# EAGLE design 6120 (EAGLE 6.6.0)
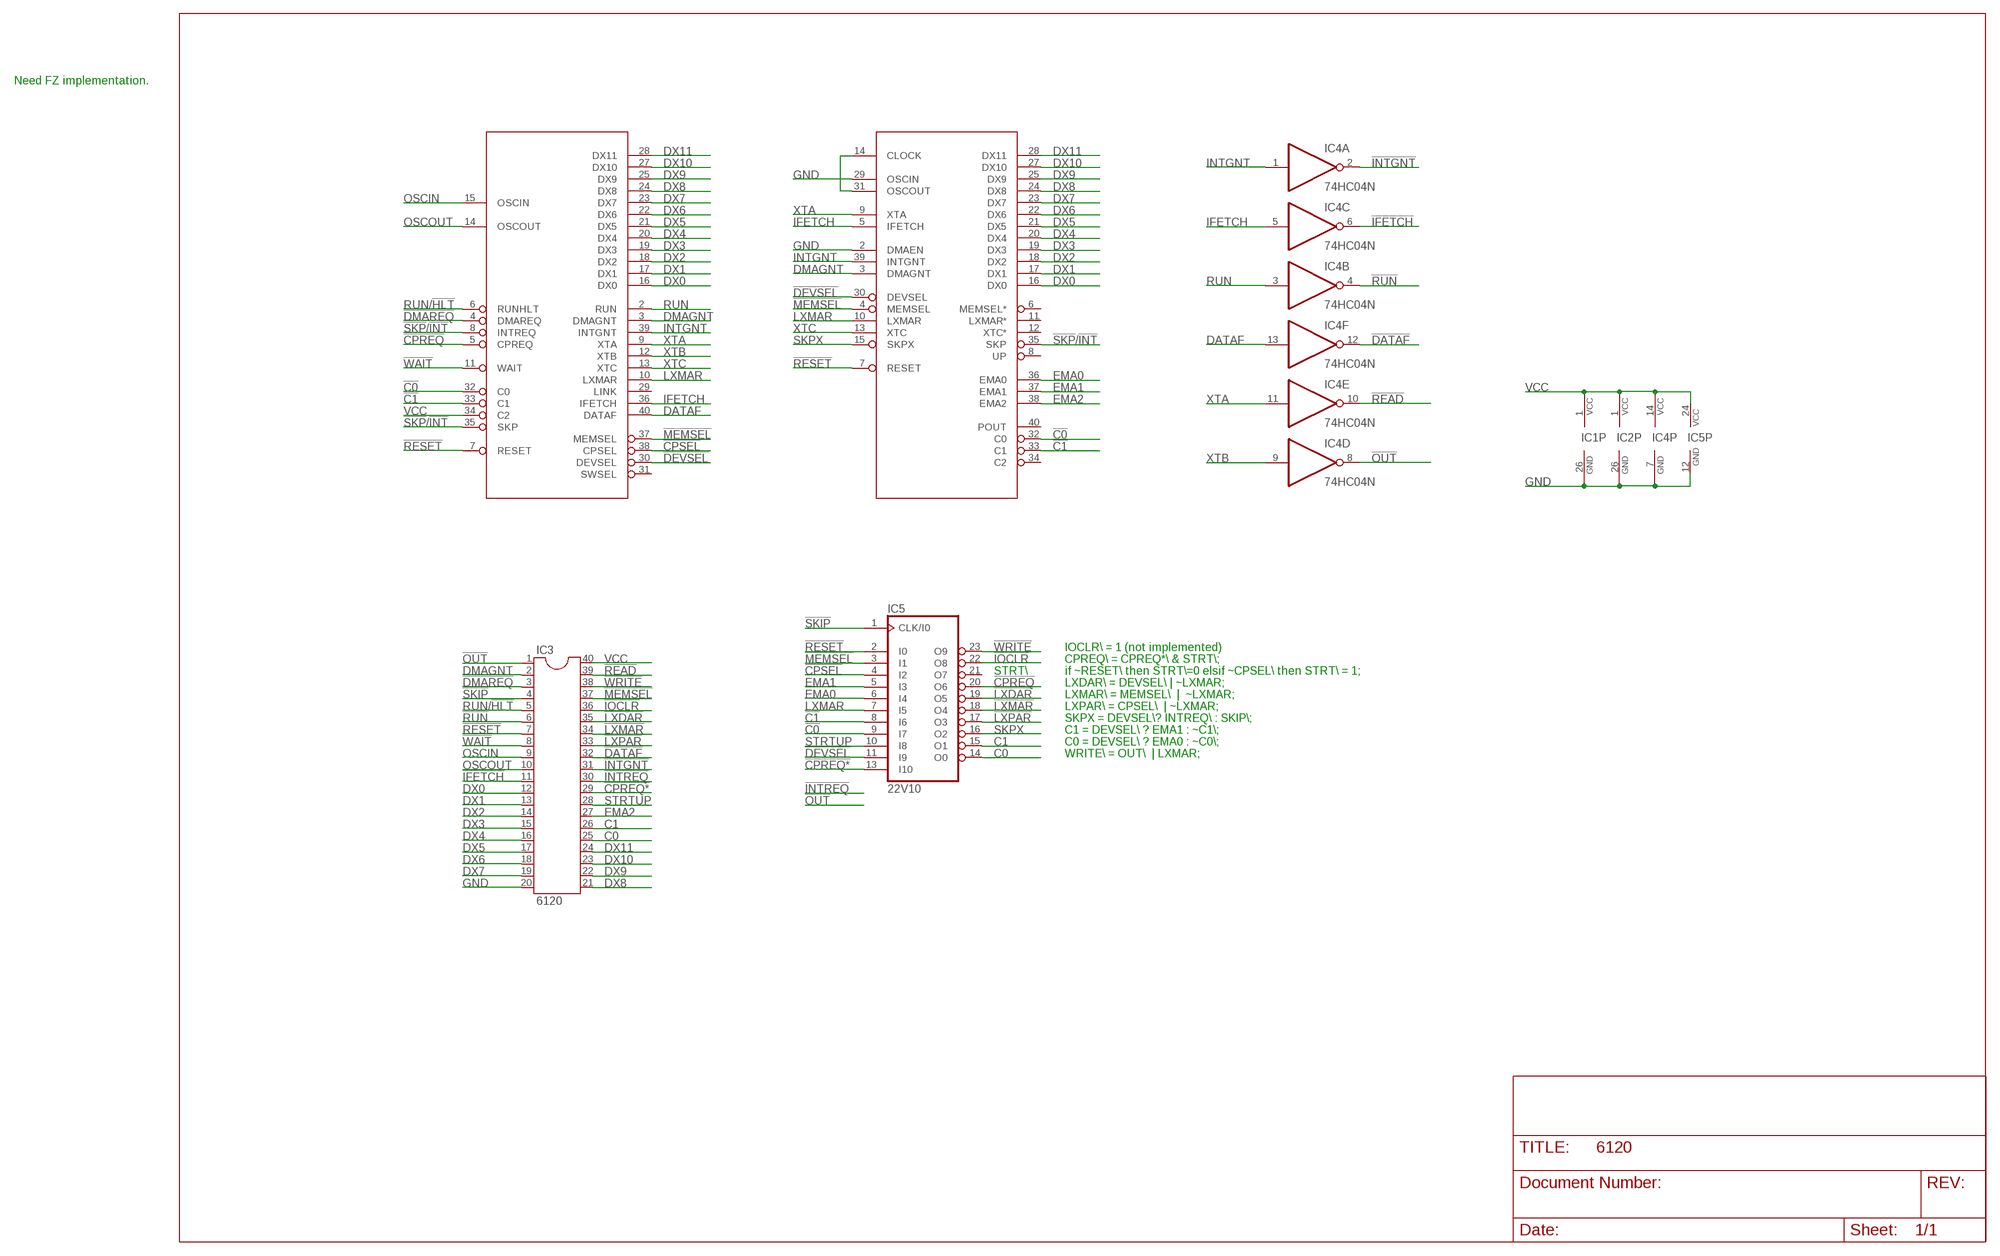
[diagram p0: schematic, sheet 1]

## Parts
IC1  IM6100  [DIL40]
IC2  IM6102  [DIL40]
IC3  6120  DIL40  [DIL40]
IC4  74HC04N  74S04N  [DIL14]
IC5  22V10  [DIL24-3]

## Nets
!C0: IC1.32(C0) IC2.32(C0) IC5.9(I7)
!C1: IC1.33(C1) IC2.33(C1) IC5.8(I6)
!CPREQ: IC1.5(CPREQ) IC5.20(O6)
!CPREQ*: IC3.29 IC5.13(I10)
!CPSEL: IC1.38(CPSEL) IC5.4(I2)
!DATAF: IC3.32 IC4.12(F:O)
!DEVSEL: IC1.30(DEVSEL) IC2.30(DEVSEL) IC5.11(I9)
!DMAREQ: IC1.4(DMAREQ) IC3.3
!IFETCH: IC3.11 IC4.6(C:O)
!INTGNT: IC3.31 IC4.2(A:O)
!INTREQ: IC3.30
!IOCLR: IC3.36 IC5.22(O8)
!LXDAR: IC3.35 IC5.19(O5)
!LXMAR: IC3.34 IC5.18(O4)
!LXPAR: IC3.33 IC5.17(O3)
!MEMSEL: IC1.37(MEMSEL) IC2.4(MEMSEL) IC3.37 IC5.3(I1)
!OUT: IC3.1 IC4.8(D:O)
!READ: IC3.39 IC4.10(E:O)
!RESET: IC1.7(RESET) IC2.7(RESET) IC3.7 IC5.2(I0)
!RUN: IC3.6 IC4.4(B:O)
!SKIP: IC3.4 IC5.1(CLK/I0)
!SKP!/!INT: IC1.8(INTREQ) IC1.35(SKP) IC2.35(SKP)
!WAIT: IC1.11(WAIT) IC3.8
!WRITE: IC3.38 IC5.23(O9)
C0: IC3.25 IC5.14(O0)
C1: IC3.26 IC5.15(O1)
DATAF: IC1.40(DATAF) IC4.13(F:I)
DMAGNT: IC1.3(DMAGNT) IC2.3(DMAGNT) IC3.2
DX0: IC1.16(DX0) IC2.16(DX0) IC3.12
DX1: IC1.17(DX1) IC2.17(DX1) IC3.13
DX2: IC1.18(DX2) IC2.18(DX2) IC3.14
DX3: IC1.19(DX3) IC2.19(DX3) IC3.15
DX4: IC1.20(DX4) IC2.20(DX4) IC3.16
DX5: IC1.21(DX5) IC2.21(DX5) IC3.17
DX6: IC1.22(DX6) IC2.22(DX6) IC3.18
DX7: IC1.23(DX7) IC2.23(DX7) IC3.19
DX8: IC1.24(DX8) IC2.24(DX8) IC3.21
DX9: IC1.25(DX9) IC2.25(DX9) IC3.22
DX10: IC1.27(DX10) IC2.27(DX10) IC3.23
DX11: IC1.28(DX11) IC2.28(DX11) IC3.24
EMA0: IC2.36(EMA0) IC5.6(I4)
EMA1: IC2.37(EMA1) IC5.5(I3)
EMA2: IC2.38(EMA2) IC3.27
GND: IC1.26(GND) IC2.2(DMAEN) IC2.26(GND) IC2.29(OSCIN) IC3.20 IC4.7(P:GND) IC5.12(GND)
IFETCH: IC1.36(IFETCH) IC2.5(IFETCH) IC4.5(C:I)
INTGNT: IC1.39(INTGNT) IC2.39(INTGNT) IC4.1(A:I)
LXMAR: IC1.10(LXMAR) IC2.10(LXMAR) IC5.7(I5)
N$1: IC2.14(CLOCK) IC2.31(OSCOUT)
OSCIN: IC1.15(OSCIN) IC3.9
OSCOUT: IC1.14(OSCOUT) IC3.10
RUN: IC1.2(RUN) IC4.3(B:I)
RUN/!HLT: IC1.6(RUNHLT) IC3.5
SKPX: IC2.15(SKPX) IC5.16(O2)
STRTUP: IC3.28 IC5.10(I8)
VCC: IC1.1(VCC) IC1.34(C2) IC2.1(VCC) IC3.40 IC4.14(P:VCC) IC5.24(VCC)
XTA: IC1.9(XTA) IC2.9(XTA) IC4.11(E:I)
XTB: IC1.12(XTB) IC4.9(D:I)
XTC: IC1.13(XTC) IC2.13(XTC)
Unconnected: IC1.29(LINK) IC1.31(SWSEL) IC2.6(MEMSEL*) IC2.8(UP) IC2.11(LXMAR*) IC2.12(XTC*) IC2.34(C2) IC2.40(POUT) IC5.21(O7)

## Notes on the sheet
- Need FZ implementation.
- IOCLR\\ = 1 (not implemented)
- CPREQ\\ = CPREQ*\\ & STRT\\;
- STRT\\ | if ~RESET\\ then STRT\\=0 elsif ~CPSEL\\ then STRT\\ = 1;
- LXDAR\\ = DEVSEL\\ | ~LXMAR;
- LXMAR\\ = MEMSEL\\  |  ~LXMAR;
- LXPAR\\ = CPSEL\\  | ~LXMAR;
- SKPX = DEVSEL\\? INTREQ\\ : SKIP\\;
- C1 = DEVSEL\\ ? EMA1 : ~C1\\;
- C0 = DEVSEL\\ ? EMA0 : ~C0\\;
- WRITE\\ = OUT\\  | LXMAR;

## Library data of the parts
IC1 = dec-con:IM6100: IM6100 PDP-8 on a chip.
IC2 = dec-con:IM6102: MEDIC MMU/DMA/RTC for IM6100.
IC3 = ic-package:DIL40: Dual In Line
IC4 = 74xx-us:74*04: Hex INVERTER
IC5 = pal:22V10: PAL; MPN: GAL22V10D-7LPN; OC_FARNELL: 1571925; OC_NEWARK: 97M0480

## Board
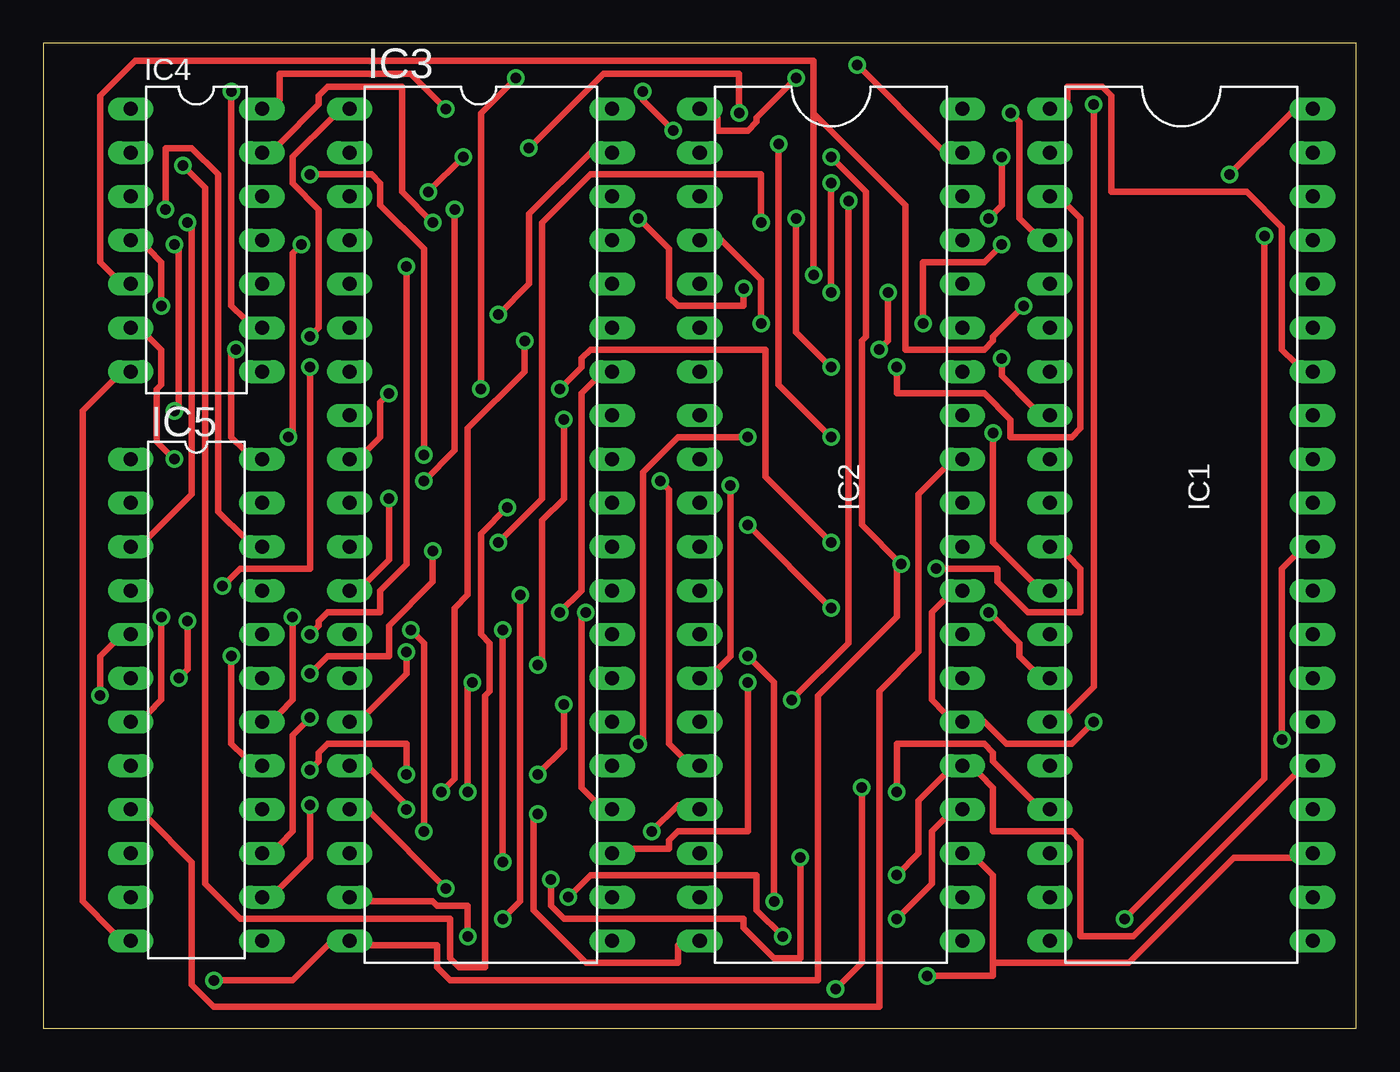
[diagram p1: board, top side]
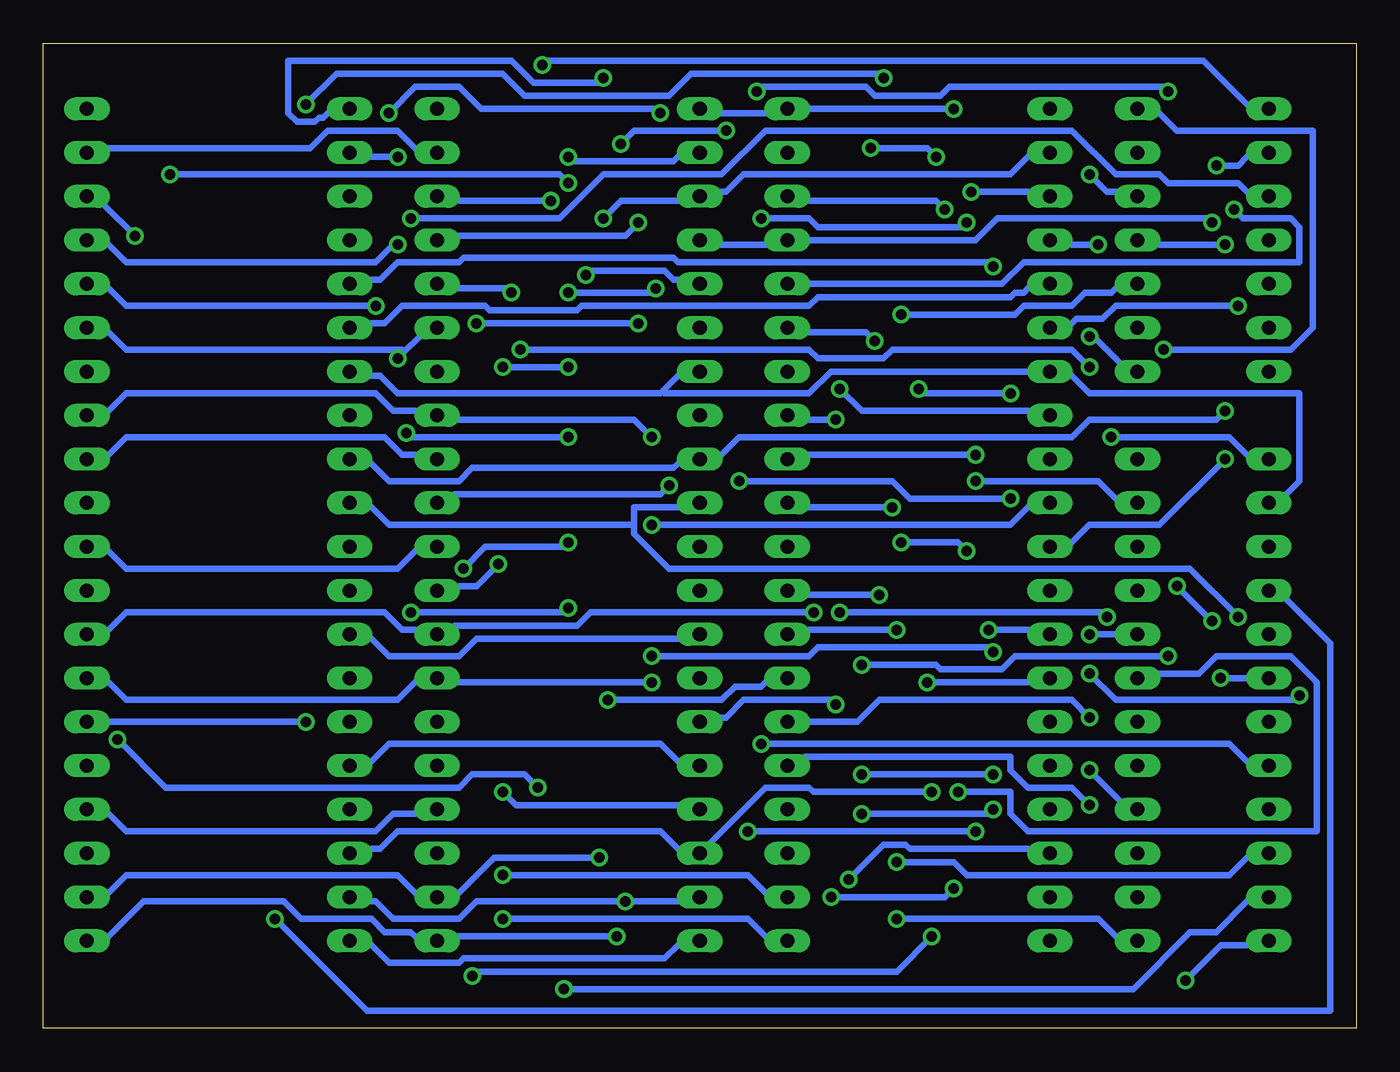
[diagram p2: board, bottom side, seen from below]

Size 76.2 x 57.15 mm. Coordinates in mm from the lower left corner, seen from the top.
Outline: 0,0 76.2,0 76.2,57.15 0,57.15 0,0
Copper layers (1*16): Top 0.035mm / dielectric 1.5mm / Bottom 0.035mm
Design rules "15mils": minimum track width 15mil, minimum drill 24mil, track to track 15mil, track to pad 10mil, pad to pad 10mil, via to via 10mil, smd to smd 10mil, copper to edge 25mil, drill to drill 10mil, minimum pad ring 10mil, minimum via ring 8mil, stop-mask expansion 0mil, vias tented up to drill 0mil, thermal gap 10mil

### Footprints (pad centres in the part's own frame; a part is rotated, then mirrored left to right if it is on the bottom)
DIL40 = drill 0.813 long: 1 -24.13,-7.62; 2 -21.59,-7.62; 3 -19.05,-7.62; 4 -16.51,-7.62; 5 -13.97,-7.62; 6 -11.43,-7.62; 7 -8.89,-7.62; 8 -6.35,-7.62; 9 -3.81,-7.62; 10 -1.27,-7.62; 11 1.27,-7.62; 12 3.81,-7.62; 13 6.35,-7.62; 14 8.89,-7.62; 15 11.43,-7.62; 16 13.97,-7.62; 17 16.51,-7.62; 18 19.05,-7.62; 19 21.59,-7.62; 20 24.13,-7.62; 21 24.13,7.62; 22 21.59,7.62; 23 19.05,7.62; 24 16.51,7.62; 25 13.97,7.62; 26 11.43,7.62; 27 8.89,7.62; 28 6.35,7.62; 29 3.81,7.62; 30 1.27,7.62; 31 -1.27,7.62; 32 -3.81,7.62; 33 -6.35,7.62; 34 -8.89,7.62; 35 -11.43,7.62; 36 -13.97,7.62; 37 -16.51,7.62; 38 -19.05,7.62; 39 -21.59,7.62; 40 -24.13,7.62
DIL14 = drill 0.813 long: 1 -7.62,-3.81; 2 -5.08,-3.81; 3 -2.54,-3.81; 4 0,-3.81; 5 2.54,-3.81; 6 5.08,-3.81; 7 7.62,-3.81; 8 7.62,3.81; 9 5.08,3.81; 10 2.54,3.81; 11 0,3.81; 12 -2.54,3.81; 13 -5.08,3.81; 14 -7.62,3.81
DIL24-3 = drill 0.813 long: 1 -13.97,-3.81; 2 -11.43,-3.81; 3 -8.89,-3.81; 4 -6.35,-3.81; 5 -3.81,-3.81; 6 -1.27,-3.81; 7 1.27,-3.81; 8 3.81,-3.81; 9 6.35,-3.81; 10 8.89,-3.81; 11 11.43,-3.81; 12 13.97,-3.81; 13 13.97,3.81; 14 11.43,3.81; 15 8.89,3.81; 16 6.35,3.81; 17 3.81,3.81; 18 1.27,3.81; 19 -1.27,3.81; 20 -3.81,3.81; 21 -6.35,3.81; 22 -8.89,3.81; 23 -11.43,3.81; 24 -13.97,3.81

### Placement (x,y rotation side)
IC1  66.04,29.21 270 top
IC2  45.72,29.21 270 top
IC3  25.4,29.21 270 top
IC4  8.89,45.72 270 top
IC5  8.89,19.05 270 top

### Tracks (layer width: path | path; a pad name or v marks a point on that pad's centre or on a via)
!C0
  Top 0.381: IC5.9 6.1,12.19 8.64,9.65 8.64,2.54 9.91,1.27 48.51,1.27 48.51,19.56 50.8,21.84 50.8,30.99 52.32,32.51 IC2.32
  Bottom 0.381: IC1.32 72.39,33.27 71.37,34.29 56.39,34.29 55.37,33.27 54.61,33.27 IC2.32
!C1  (via drill 0.61)
  Top 0.381: v34.54,16.51 34.8,16.76 34.8,32.26 36.83,34.29 v40.89,34.29
  Bottom 0.381: v34.54,16.51 7.37,16.51 6.35,15.49 IC5.8 | v40.89,34.29 41.91,35.31 52.07,35.31 IC2.33 54.61,35.81 55.88,35.81 56.9,36.83 71.37,36.83 72.39,35.81 IC1.33
!CPREQ  (via drill 0.61)
  Top 0.381: v15.49,22.86 16,23.37 16,23.62 16.51,24.13 19.56,24.13 19.56,25.4 21.08,26.92 v21.08,44.2
  Bottom 0.381: v21.08,44.2 21.34,44.45 39.37,44.45 39.62,44.7 51.82,44.7 52.07,44.45 55.63,44.45 56.64,43.43 57.15,43.43 IC1.5 | IC5.20 v15.49,22.86
!CPREQ*  (via drill 0.61)
  Top 0.381: v26.67,6.35 27.69,7.37 v27.69,25.15
  Bottom 0.381: v26.67,6.35 14.99,6.35 13.97,5.33 IC5.13 | v27.69,25.15 31.75,25.15 IC3.29
!CPSEL  (via drill 0.61)
  Top 0.381: v62.74,6.35 70.87,14.48 v70.87,45.97
  Bottom 0.381: v62.74,6.35 57.4,1.02 1.52,1.02 1.52,22.35 4.06,24.89 IC5.4 | v70.87,45.97 72.64,47.75 IC1.38
!DATAF  (via drill 0.61)
  Top 0.381: v22.1,33.27 22.1,45.21 19.56,47.75 19.56,49.02 19.05,49.53 v15.49,49.53
  Bottom 0.381: v22.1,33.27 31.75,33.27 IC3.32 | v15.49,49.53 14.48,48.51 13.97,48.51 IC4.12
!DEVSEL  (via drill 0.61)
  Top 0.381: v45.97,2.29 47.5,3.81 v47.5,13.97 | v71.88,16.76 71.88,26.67 72.64,27.43 IC1.30
  Bottom 0.381: v45.97,2.29 12.95,2.29 9.65,5.59 8.13,5.59 6.35,7.37 IC5.11 | v47.5,13.97 48.26,14.73 51.31,14.73 52.07,13.97 69.09,13.97 v71.88,16.76 | IC2.30 54.61,27.69 55.63,26.67 71.37,26.67 72.39,27.69 IC1.30
!DMAREQ  (via drill 0.61)
  Top 0.381: v22.35,48.51 v24.38,50.55 | v28.19,51.05 32.51,55.37 40.39,55.37 v40.39,53.09 | v56.13,53.09 56.64,52.58 56.64,46.99 57.4,46.23 IC1.4
  Bottom 0.381: v22.35,48.51 19.05,48.51 IC3.3 | v24.38,50.55 24.89,51.05 v28.19,51.05 | v40.39,53.09 40.64,53.34 50.8,53.34 52.07,54.61 54.61,54.61 v56.13,53.09
!IFETCH  (via drill 0.61)
  Top 0.381: v7.62,33.02 6.6,34.04 6.6,37.08 6.86,37.34 6.86,39.37 6.1,40.13 IC4.6
  Bottom 0.381: v7.62,33.02 11.43,29.21 15.49,29.21 16.51,28.19 IC3.11
!INTGNT  (via drill 0.61)
  Top 0.381: v8.13,50.04 9.4,48.77 9.4,8.38 11.43,6.35 23.62,6.35 23.62,4.06 24.13,3.56 25.65,3.56 25.65,19.3 25.91,19.56 25.91,22.35 25.4,22.86 25.4,28.7 v26.92,30.23
  Bottom 0.381: v8.13,50.04 6.86,50.04 6.35,50.55 IC4.2 | v26.92,30.23 31.75,30.23 IC3.31
!IOCLR  (via drill 0.61)
  Top 0.381: v7.11,47.5 7.11,51.05 8.64,51.05 10.16,49.53 10.16,29.97 11.68,28.45 IC5.22
  Bottom 0.381: v7.11,47.5 6.6,46.99 3.81,46.99 3.3,46.48 3.3,44.45 19.3,44.45 20.57,43.18 IC3.36
!LXDAR  (via drill 0.61)
  Top 0.381: v23.11,13.72 23.88,14.48 23.88,24.38 24.64,25.15 24.64,34.8 27.94,38.1 v27.94,39.88
  Bottom 0.381: v23.11,13.72 20.07,13.72 20.07,12.45 19.05,11.43 2.29,11.43 2.29,20.07 3.81,21.59 8.13,21.59 9.14,20.57 11.43,20.57 IC5.19 | v27.94,39.88 28.45,40.39 31.75,40.39 IC3.35
!LXMAR  (via drill 0.61)
  Top 0.381: v14.48,23.88 14.48,19.05 13.72,18.29 IC5.18 | v29.97,24.13 31.24,25.4 31.24,36.83 32,37.59 IC3.34
  Bottom 0.381: v14.48,23.88 14.73,24.13 v29.97,24.13
!LXPAR  (via drill 0.61)
  Top 0.381: v10.92,21.59 10.92,16.51 11.68,15.75 IC5.17 | v28.7,21.08 28.96,21.34 28.96,29.46 30.23,30.73 v30.23,35.31
  Bottom 0.381: v10.92,21.59 19.81,21.59 20.57,20.83 24.13,20.83 24.38,21.08 v28.7,21.08 | v30.23,35.31 31.75,35.31 IC3.33
!MEMSEL  (via drill 0.61)
  Top 0.381: v8.38,46.74 8.64,46.48 8.64,30.99 6.1,28.45 IC5.3 | v55.63,45.47 54.61,44.45 51.05,44.45 v51.05,40.89 | v41.66,40.89 41.66,43.43 39.37,45.72 IC2.4
  Bottom 0.381: v8.38,46.74 8.64,46.99 20.83,46.99 22.1,45.72 IC3.37 34.29,45.47 36.83,45.47 IC2.4 | v55.63,45.47 55.88,45.47 56.9,44.45 71.37,44.45 72.39,45.47 IC1.37 | v41.66,40.89 v51.05,40.89
!OUT  (via drill 0.61)
  Top 0.381: v15.49,40.13 16,40.64 16,47.5 14.48,49.02 14.48,50.55 16.76,52.83 IC3.1
  Bottom 0.381: v15.49,40.13 15.24,40.13 13.72,38.61 IC4.8
!READ  (via drill 0.61)
  Top 0.381: v26.42,41.4 28.19,43.18 28.19,47.24 31.75,50.8 IC3.39
  Bottom 0.381: v26.42,41.4 19.81,41.4 19.3,41.91 16.51,41.91 15.75,42.67 14.22,42.67 13.97,42.93 IC4.10
!RESET
  Bottom 0.381: IC5.2 4.06,30.99 3.3,31.75 3.3,36.83 15.49,36.83 16.51,37.85 IC3.7 30.48,38.1 31.75,36.83 40.13,36.83 40.26,36.96 | 40.26,36.96 40.39,36.83 55.63,36.83 56.64,37.85 57.15,37.85 IC1.7 | 40.26,36.96 39.37,37.85 IC2.7
!RUN  (via drill 0.61)
  Top 0.381: v6.86,41.91 6.86,44.45 6.1,45.21 IC4.4
  Bottom 0.381: v6.86,41.91 13.97,41.91 14.73,41.15 16.26,41.15 16.51,40.89 IC3.6
!SKIP  (via drill 0.61)
  Top 0.381: v14.22,34.29 14.48,34.54 14.48,44.96 v14.99,45.47
  Bottom 0.381: v14.22,34.29 7.37,34.29 6.35,33.27 IC5.1 | v14.99,45.47 16.51,45.47 IC3.4
!SKP!/!INT  (via drill 0.61)
  Top 0.381: v55.63,38.86 55.63,37.85 57.4,36.07 IC1.8
  Bottom 0.381: 55.24,39.24 54.36,40.13 IC2.35 | v55.63,38.86 55.24,39.24 | IC1.35 72.39,40.39 71.37,39.37 55.37,39.37 55.24,39.24
!WAIT  (via drill 0.61)
  Top 0.381: v29.97,37.08 31.24,38.35 31.24,38.86 31.75,39.37 41.91,39.37 41.91,32 v45.72,28.19 | v51.82,26.67 55.37,26.67 55.37,25.91 57.15,24.13 60.2,24.13 60.2,26.67 59.44,27.43 IC1.11
  Bottom 0.381: v29.97,37.08 28.7,35.81 19.05,35.81 IC3.8 | v45.72,28.19 45.97,27.94 50.55,27.94 v51.82,26.67
!WRITE  (via drill 0.61)
  Top 0.381: v22.1,31.75 23.88,33.53 v23.88,47.5
  Bottom 0.381: v22.1,31.75 14.99,31.75 13.97,30.73 IC5.23 | v23.88,47.5 24.38,48.01 31.75,48.01 IC3.38
C0  (via drill 0.61)
  Top 0.381: v15.49,12.95 15.49,9.91 13.72,8.13 IC5.14
  Bottom 0.381: v15.49,12.95 16.51,13.97 19.05,13.97 20.07,14.99 20.07,15.75 32,15.75 IC3.25
C1  (via drill 0.61)
  Top 0.381: v15.49,18.03 14.48,17.02 14.48,11.43 13.72,10.67 IC5.15
  Bottom 0.381: v15.49,18.03 16.51,19.05 27.69,19.05 28.96,17.78 IC3.26
DATAF  (via drill 0.61)
  Top 0.381: v22.61,46.74 20.83,48.51 20.83,54.61 16.51,54.61 16,54.1 16,53.59 13.72,51.31 IC4.13 | v34.54,46.99 36.32,45.21 36.32,42.42 36.83,41.91 40.64,41.91 v40.64,42.93 | v45.72,42.67 v45.72,49.02 | v68.83,49.53 72.39,53.09 IC1.40
  Bottom 0.381: v22.61,46.74 22.86,46.48 31.24,46.48 31.75,46.99 v34.54,46.99 | v40.64,42.93 40.89,42.67 v45.72,42.67 | v45.72,49.02 46.23,49.53 v68.83,49.53
DMAGNT  (via drill 0.61)
  Top 0.381: v49.53,38.35 49.53,36.83 54.61,36.83 56.13,35.31 56.13,34.29 59.69,34.29 60.2,34.8 60.2,46.99 59.44,47.75 IC1.3 | v45.72,38.35 43.69,40.39 v43.69,46.99
  Bottom 0.381: IC3.2 19.05,50.55 20.07,49.53 35.56,49.53 36.58,48.51 36.83,48.51 IC2.3 39.37,48.01 42.67,48.01 v43.69,46.99 | v45.72,38.35 v49.53,38.35
DX0  (via drill 0.61)
  Top 0.381: v20.07,30.73 20.07,27.18 18.8,25.91 IC3.12 | v35.81,31.75 36.32,31.24 36.32,16.51 37.08,15.75 IC2.16
  Bottom 0.381: IC2.16 39.37,15.49 40.39,16.51 56.13,16.51 57.15,15.49 IC1.16 | v20.07,30.73 25.91,30.73 26.92,31.75 v35.81,31.75
DX1  (via drill 0.61)
  Top 0.381: v21.34,23.11 22.1,22.35 v22.1,11.43 | v35.31,11.43 36.83,12.95 IC2.17 | v49.53,13.72 49.53,16.51 54.61,16.51 55.12,16 55.12,15.49 57.4,13.21 IC1.17
  Bottom 0.381: v21.34,23.11 19.05,23.11 IC3.13 | v22.1,11.43 v35.31,11.43 | v49.53,13.72 48.77,12.95 39.37,12.95 IC2.17
DX2  (via drill 0.61)
  Top 0.381: v24.89,20.07 24.64,19.81 v24.64,13.72
  Bottom 0.381: IC1.18 57.15,10.41 56.64,10.41 55.63,11.43 40.39,11.43 39.37,10.41 IC2.18 34.29,13.97 31.75,13.97 31.5,13.72 v24.64,13.72 | v24.89,20.07 19.05,20.07 IC3.14
DX3  (via drill 0.61)
  Top 0.381: v21.08,21.84 21.08,20.57 18.8,18.29 IC3.15 | v40.89,21.59 42.42,20.07 v42.42,7.37
  Bottom 0.381: IC2.19 39.37,7.37 v42.42,7.37 51.05,7.37 52.07,6.35 55.88,6.35 56.9,7.37 57.15,7.37 IC1.19 | v21.08,21.84 21.34,22.1 31.24,22.1 31.75,21.59 v40.89,21.59
DX4  (via drill 0.61)
  Top 0.381: v21.08,12.7 21.08,12.95 19.05,14.99 IC3.16 | v28.7,12.45 28.45,12.19 28.45,6.86 31.5,3.81 36.83,3.81 36.83,4.83 IC2.20
  Bottom 0.381: IC2.20 39.37,4.83 40.13,4.06 51.82,4.06 52.07,3.81 56.13,3.81 57.15,4.83 IC1.20 | v21.08,12.7 21.34,12.45 v28.7,12.45
DX5  (via drill 0.61)
  Top 0.381: v23.37,8.13 19.05,12.45 IC3.17 | v30.48,7.62 31.75,8.89 41.4,8.89 41.4,6.86 v42.93,5.33
  Bottom 0.381: IC1.21 72.39,5.33 70.36,7.37 62.23,7.37 61.21,6.35 57.15,6.35 56.39,5.59 54.86,5.59 54.61,5.33 IC2.21 52.07,5.33 v42.93,5.33 | v23.37,8.13 23.88,7.62 v30.48,7.62
DX6  (via drill 0.61)
  Top 0.381: v29.46,8.64 29.46,7.11 30.23,6.35 40.64,6.35 40.64,5.84 42.42,4.06 43.94,4.06 v43.94,9.91
  Bottom 0.381: IC1.22 72.39,7.87 71.37,8.89 55.63,8.89 54.61,7.87 IC2.22 52.07,7.87 50.04,9.91 v43.94,9.91 | v29.46,8.64 27.43,10.67 26.16,10.67 25.91,10.41 19.05,10.41 IC3.18
DX7  (via drill 0.61)
  Top 0.381: v24.64,5.33 24.64,7.11 22.86,7.11 22.61,7.37 19.05,7.37 IC3.19 | v51.31,3.05 55.12,3.05 55.12,3.81 | 55.12,3.81 55.12,8.89 54.36,9.65 IC2.23 | 55.12,3.81 62.99,3.81 69.09,9.91 72.39,9.91 IC1.23
  Bottom 0.381: v24.64,5.33 26.67,3.3 51.05,3.3 v51.31,3.05
DX8  (via drill 0.61)
  Top 0.381: v49.53,6.35 51.56,8.38 51.56,11.43 52.32,12.19 IC2.24
  Bottom 0.381: v49.53,6.35 35.31,6.35 34.29,5.33 IC3.21 | IC1.24 72.39,12.45 71.37,11.43 56.9,11.43 55.88,12.45 54.61,12.45 IC2.24
DX9  (via drill 0.61)
  Top 0.381: v49.53,8.89 50.8,10.16 50.8,13.21 52.32,14.73 IC2.25 54.36,14.73 55.12,13.97 55.12,11.43 59.69,11.43 60.2,10.92 60.2,5.33 63.25,5.33 72.64,14.73 IC1.25
  Bottom 0.381: v49.53,8.89 35.31,8.89 34.29,7.87 IC3.22
DX10  (via drill 0.61)
  Top 0.381: v40.89,20.07 40.89,11.43 36.83,11.43 36.32,10.92 36.32,10.41 34.29,10.41 IC3.23
  Bottom 0.381: v40.89,20.07 52.07,20.07 IC2.27 54.61,20.07 55.63,19.05 71.37,19.05 72.39,20.07 IC1.27
DX11  (via drill 0.61)
  Top 0.381: v31.5,24.13 31.24,23.88 31.24,13.97 32,13.21 IC3.24
  Bottom 0.381: v31.5,24.13 44.45,24.13 45.21,23.37 52.32,23.37 IC2.28 54.61,23.11 55.37,23.11 56.39,24.13 71.37,24.13 72.39,23.11 IC1.28
EMA0  (via drill 0.61)
  Top 0.381: v7.87,20.32 8.38,20.83 v8.38,23.62 | v10.41,25.65 11.43,26.67 15.49,26.67 v15.49,38.35 | v48.51,39.37 49.02,39.88 v49.02,42.67
  Bottom 0.381: v8.38,23.62 v10.41,25.65 | v15.49,38.35 16.51,39.37 26.92,39.37 27.43,38.86 31.24,38.86 31.75,39.37 v48.51,39.37 | v49.02,42.67 49.28,42.93 52.07,42.93 IC2.36 | IC5.6 v7.87,20.32
EMA1  (via drill 0.61)
  Top 0.381: v3.3,19.3 3.3,21.59 4.06,22.35 IC5.5 | v15.49,20.57 16.51,21.59 20.07,21.59 20.07,23.37 22.61,25.91 v22.61,27.69 | v26.42,28.19 28.96,30.73 28.96,46.74 31.75,49.53 41.66,49.53 v41.66,46.74
  Bottom 0.381: v3.3,19.3 3.56,19.05 13.97,19.05 v15.49,20.57 | v22.61,27.69 23.11,28.19 v26.42,28.19 | v41.66,46.74 42.42,45.97 52.07,45.97 IC2.37
EMA2  (via drill 0.61)
  Top 0.381: v43.43,19.05 46.74,22.35 v46.74,48.01
  Bottom 0.381: v43.43,19.05 36.83,19.05 36.07,19.81 34.54,19.81 34.29,20.07 IC3.27 | v46.74,48.01 52.07,48.01 IC2.38
GND  (via drill 0.61)
  Top 0.381: IC5.12 4.06,5.59 2.29,7.37 2.29,35.81 4.06,37.59 IC4.7 | v9.91,2.79 14.48,2.79 16.51,4.83 IC3.20 19.05,4.83 22.86,4.83 22.86,3.56 23.62,2.79 44.96,2.79 44.96,19.3 49.53,23.88 49.53,26.67 v49.78,26.92 47.5,29.21 47.5,39.88 47.75,40.13 47.75,48.51 v45.72,50.55 | IC2.29 52.32,24.89 51.56,24.13 51.56,19.05 52.32,18.29 IC2.26 54.61,17.78 55.88,16.51 59.69,16.51 v60.96,17.78
  Bottom 0.381: v9.91,2.79 7.87,4.83 6.35,4.83 IC5.12 | v45.72,50.55 45.47,50.29 39.62,50.29 39.37,50.55 IC2.2 | v49.78,26.92 51.05,25.65 52.07,25.65 IC2.29 | v60.96,17.78 IC1.26
IFETCH  (via drill 0.61)
  Top 0.381: 44.7,53.09 v44.7,43.69 | 44.7,53.09 44.7,56.13 5.33,56.13 3.3,54.1 3.3,44.45 4.06,43.69 IC4.5 | v56.9,41.91 55.12,40.13 55.12,39.88 54.61,39.37 50.04,39.37 50.04,47.75 44.7,53.09
  Bottom 0.381: v44.7,43.69 44.45,43.94 40.13,43.94 39.62,43.43 39.37,43.43 IC2.5 | v56.9,41.91 71.37,41.91 72.39,42.93 IC1.36
INTGNT  (via drill 0.61)
  Top 0.381: v47.24,55.88 52.07,51.05 IC2.39
  Bottom 0.381: IC2.39 54.61,51.05 55.63,52.07 59.69,52.07 60.71,51.05 72.39,51.05 IC1.39 | v47.24,55.88 46.99,56.13 8.89,56.13 6.35,53.59 IC4.1
LXMAR  (via drill 0.61)
  Top 0.381: v6.86,23.88 6.86,19.05 6.1,18.29 IC5.7
  Bottom 0.381: v6.86,23.88 9.65,26.67 39.88,26.67 41.91,28.7 41.91,29.21 | 41.91,29.21 41.91,30.23 39.37,30.23 IC2.10 | 41.91,29.21 56.13,29.21 57.15,30.23 IC1.10
N$1  (via drill 0.61)
  Top 0.381: v39.88,31.5 39.88,21.59 39.12,20.83 IC2.14
  Bottom 0.381: v39.88,31.5 40.39,30.99 52.32,30.99 IC2.31
OSCIN  (via drill 0.61)
  Top 0.381: v60.96,53.59 60.96,19.81 59.44,18.29 IC1.15 | v27.43,55.12 25.4,53.09 v25.4,37.08 | v20.07,36.83 19.56,36.32 19.56,34.29 18.8,33.53 IC3.9
  Bottom 0.381: v60.96,53.59 59.18,55.37 49.53,55.37 48.26,54.1 39.88,54.1 38.61,55.37 27.69,55.37 v27.43,55.12 | v25.4,37.08 25.15,36.83 v20.07,36.83
OSCOUT  (via drill 0.61)
  Top 0.381: v40.89,29.21 v45.72,24.38 | v54.86,24.13 56.64,22.35 56.64,21.59 57.4,20.83 IC1.14
  Bottom 0.381: v40.89,29.21 20.07,29.21 19.05,30.23 IC3.10 | v45.72,24.38 45.97,24.13 v54.86,24.13
RUN  (via drill 0.61)
  Top 0.381: v54.86,46.99 55.63,47.75 v55.63,50.55
  Bottom 0.381: v54.86,46.99 46.23,46.99 43.69,49.53 36.83,49.53 34.29,52.07 16.51,52.07 13.97,49.53 11.43,49.53 10.92,49.02 6.86,49.02 6.35,48.51 IC4.3 | v55.63,50.55 57.15,50.55 IC1.2
RUN/!HLT
  Bottom 0.381: IC3.5 19.05,42.93 19.3,42.67 19.81,42.67 20.07,42.42 31.24,42.42 31.75,41.91 44.96,41.91 45.21,41.66 50.29,41.66 50.55,41.91 55.37,41.91 56.39,40.89 57.15,40.89 IC1.6
SKPX  (via drill 0.61)
  Top 0.381: v15.49,14.99 16,15.49 16,16 16.51,16.51 21.08,16.51 v21.08,14.73 | v28.7,14.73 30.23,16.26 v30.23,18.8
  Bottom 0.381: v15.49,14.99 13.72,13.21 IC5.16 | v21.08,14.73 v28.7,14.73 | v30.23,18.8 30.48,19.05 35.56,19.05 36.58,18.03 36.83,18.03 IC2.15
STRTUP  (via drill 0.61)
  Top 0.381: v26.67,9.65 v26.67,23.11
  Bottom 0.381: v26.67,9.65 23.37,9.65 22.61,8.89 7.37,8.89 6.35,9.91 IC5.10 | v26.67,23.11 31.75,23.11 IC3.28
VCC  (via drill 0.61)
  Top 0.381: IC1.34 72.64,38.61 71.88,39.37 71.88,46.48 69.85,48.51 61.98,48.51 61.98,54.1 61.47,54.61 59.44,54.61 59.44,53.85 IC1.1 | v11.18,39.37 10.92,39.12 10.92,34.29 11.68,33.53 IC5.24 | v23.37,53.34 21.34,55.37 13.72,55.37 13.72,53.85 IC4.14 | v43.69,55.12 41.4,52.83 41.4,52.58 40.89,52.07 39.12,52.07 39.12,52.83 IC2.1
  Bottom 0.381: IC2.1 36.83,53.09 34.29,53.09 IC3.40 v23.37,53.34 | v11.18,39.37 3.81,39.37 2.54,40.64 2.54,52.07 10.41,52.07 11.43,53.09 IC4.14 | v43.69,55.12 43.94,54.86 47.75,54.86 49.02,56.13 61.98,56.13 61.98,53.09 61.47,52.58 60.45,52.58 60.2,52.83 59.94,52.83 59.69,53.09 IC1.1
XTA  (via drill 0.61)
  Top 0.381: v7.62,45.47 7.87,45.21 7.87,36.07 v7.62,35.81
  Bottom 0.381: IC1.9 57.15,32.77 56.13,31.75 52.07,31.75 51.31,32.51 39.62,32.51 39.37,32.77 IC2.9 36.83,33.27 35.81,34.29 16.51,34.29 15.49,35.31 8.13,35.31 v7.62,35.81 | v7.62,45.47 11.43,45.47 IC4.11
XTB  (via drill 0.61)
  Top 0.381: v55.12,34.54 55.12,28.19 57.4,25.91 IC1.12 | v45.72,34.29 42.67,37.34 v42.67,51.31 | v36.58,52.07 34.8,53.85 v34.8,54.36 | v10.92,54.36 10.92,41.91 11.68,41.15 IC4.9
  Bottom 0.381: v55.12,34.54 54.86,34.29 v45.72,34.29 | v42.67,51.31 41.91,52.07 v36.58,52.07 | v34.8,54.36 34.54,54.61 28.45,54.61 27.94,54.1 24.13,54.1 23.62,54.61 11.18,54.61 v10.92,54.36
XTC
  Bottom 0.381: IC2.13 39.37,22.61 51.05,22.61 52.07,21.59 56.13,21.59 57.15,22.61 IC1.13